# Altium schematic sheet Schematic.SchDoc
size A4; SheetNumber: 1; SheetTotal: 1
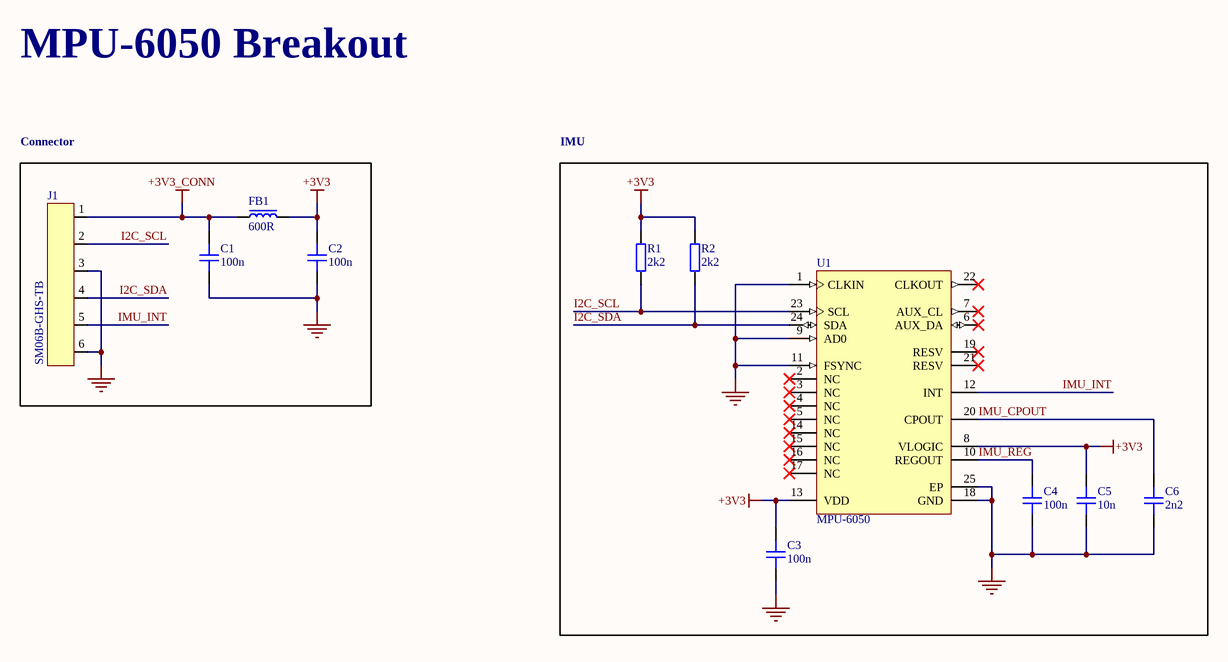
[diagram p0: Schematic.SchDoc]

## Parts
C1  100n  [CAP_0402]
C2  100n  [CAP_0402]
C3  100n  [CAP_0402]
C4  100n  [CAP_0402]
C5  10n  [CAP_0402]
C6  2n2  [CAP_0402]
FB1  600R  [FB_0402]
J1  SM06B-GHS-TB  [SM06B-GHS-TB]
R1  2k2  [RES_0402]
R2  2k2  [RES_0402]
U1  MPU-6050  [IS-QFN-24_V]

## Blocks framed on the sheet
Connector: C1 C2 FB1 J1
IMU: C3-C6 R1 R2 U1

## Nets
+3V3: C2.1 C3.1 C5.1 FB1.2 R1.2 R2.2 U1.8(VLOGIC) U1.13(VDD)
+3V3_CONN: C1.1 FB1.1 J1.1
GND: C1.2 C2.2 C3.2 C4.2 C5.2 C6.2 J1.3 J1.6 U1.1(CLKIN) U1.9(AD0) U1.11(FSYNC) U1.18(GND) U1.25(EP)
I2C_SCL: J1.2 R1.1 U1.23(SCL)
I2C_SDA: J1.4 R2.1 U1.24(SDA)
IMU_CPOUT: C6.1 U1.20(CPOUT)
IMU_INT: J1.5 U1.12(INT)
IMU_REG: C4.1 U1.10(REGOUT)

Not connected (* = marked no-connect by the designer): U1 2(NC)* 3(NC)* 4(NC)* 5(NC)* 6(AUX_DA)* 7(AUX_CL)* 14(NC)* 15(NC)* 16(NC)* 17(NC)* 19(RESV)* 21(RESV)* 22(CLKOUT)*

## Notes on the sheet
- MPU-6050 Breakout

## Library data of the parts
C1-C6 = CAP_0402_10V: Capacitor SMD 0402 10V
FB1 = FB_0402: Ferrite Bead SMD 0402
J1 = SM06B-GHS-TB: Header Connector 6 Position 1.25MM Pitch SMD Horizontal JST GH; Manufacturer: JST; Manufacturer Part Number: SM06B-GHS-TB
R1 R2 = RES_0402: Resistor SMD 0402
U1 = CMP-1753-00002-2: 3-Axis Gyroscope, Accelerometer and a Digital Motion Processor(TM) (DMP), 2.375 to 3.46 V, -40 to 85 degC, 24-Pin QFN, RoHS, Tape and Reel; Manufacturer: InvenSense; Featured Product: MPU-60506-Axis,IntegratedI²CSolution; Other Names: 1428-1007-2 / MPU6050; Sensor Type: MotionTracking; Online Catalog: MPU-6000™Series; Unit PriceUSD: Digital; Datasheet Version: Rev. 3.3, 05/2012; Category: Sensors,Transducers; Datasheet URL: http://datasheet.octopart.com/MPU-6050-InvenSense-datasheet-14421344.pdf; Family: Multifunction; Standard Package: 5,000; Manufacturer URL: http://www.invensense.com/; Output Type: Digital; Dynamic Catalog: MPU-6000™Series